# EAGLE schematic SUSTAINA-Control-Switches-Board (EAGLE 9.6.2)
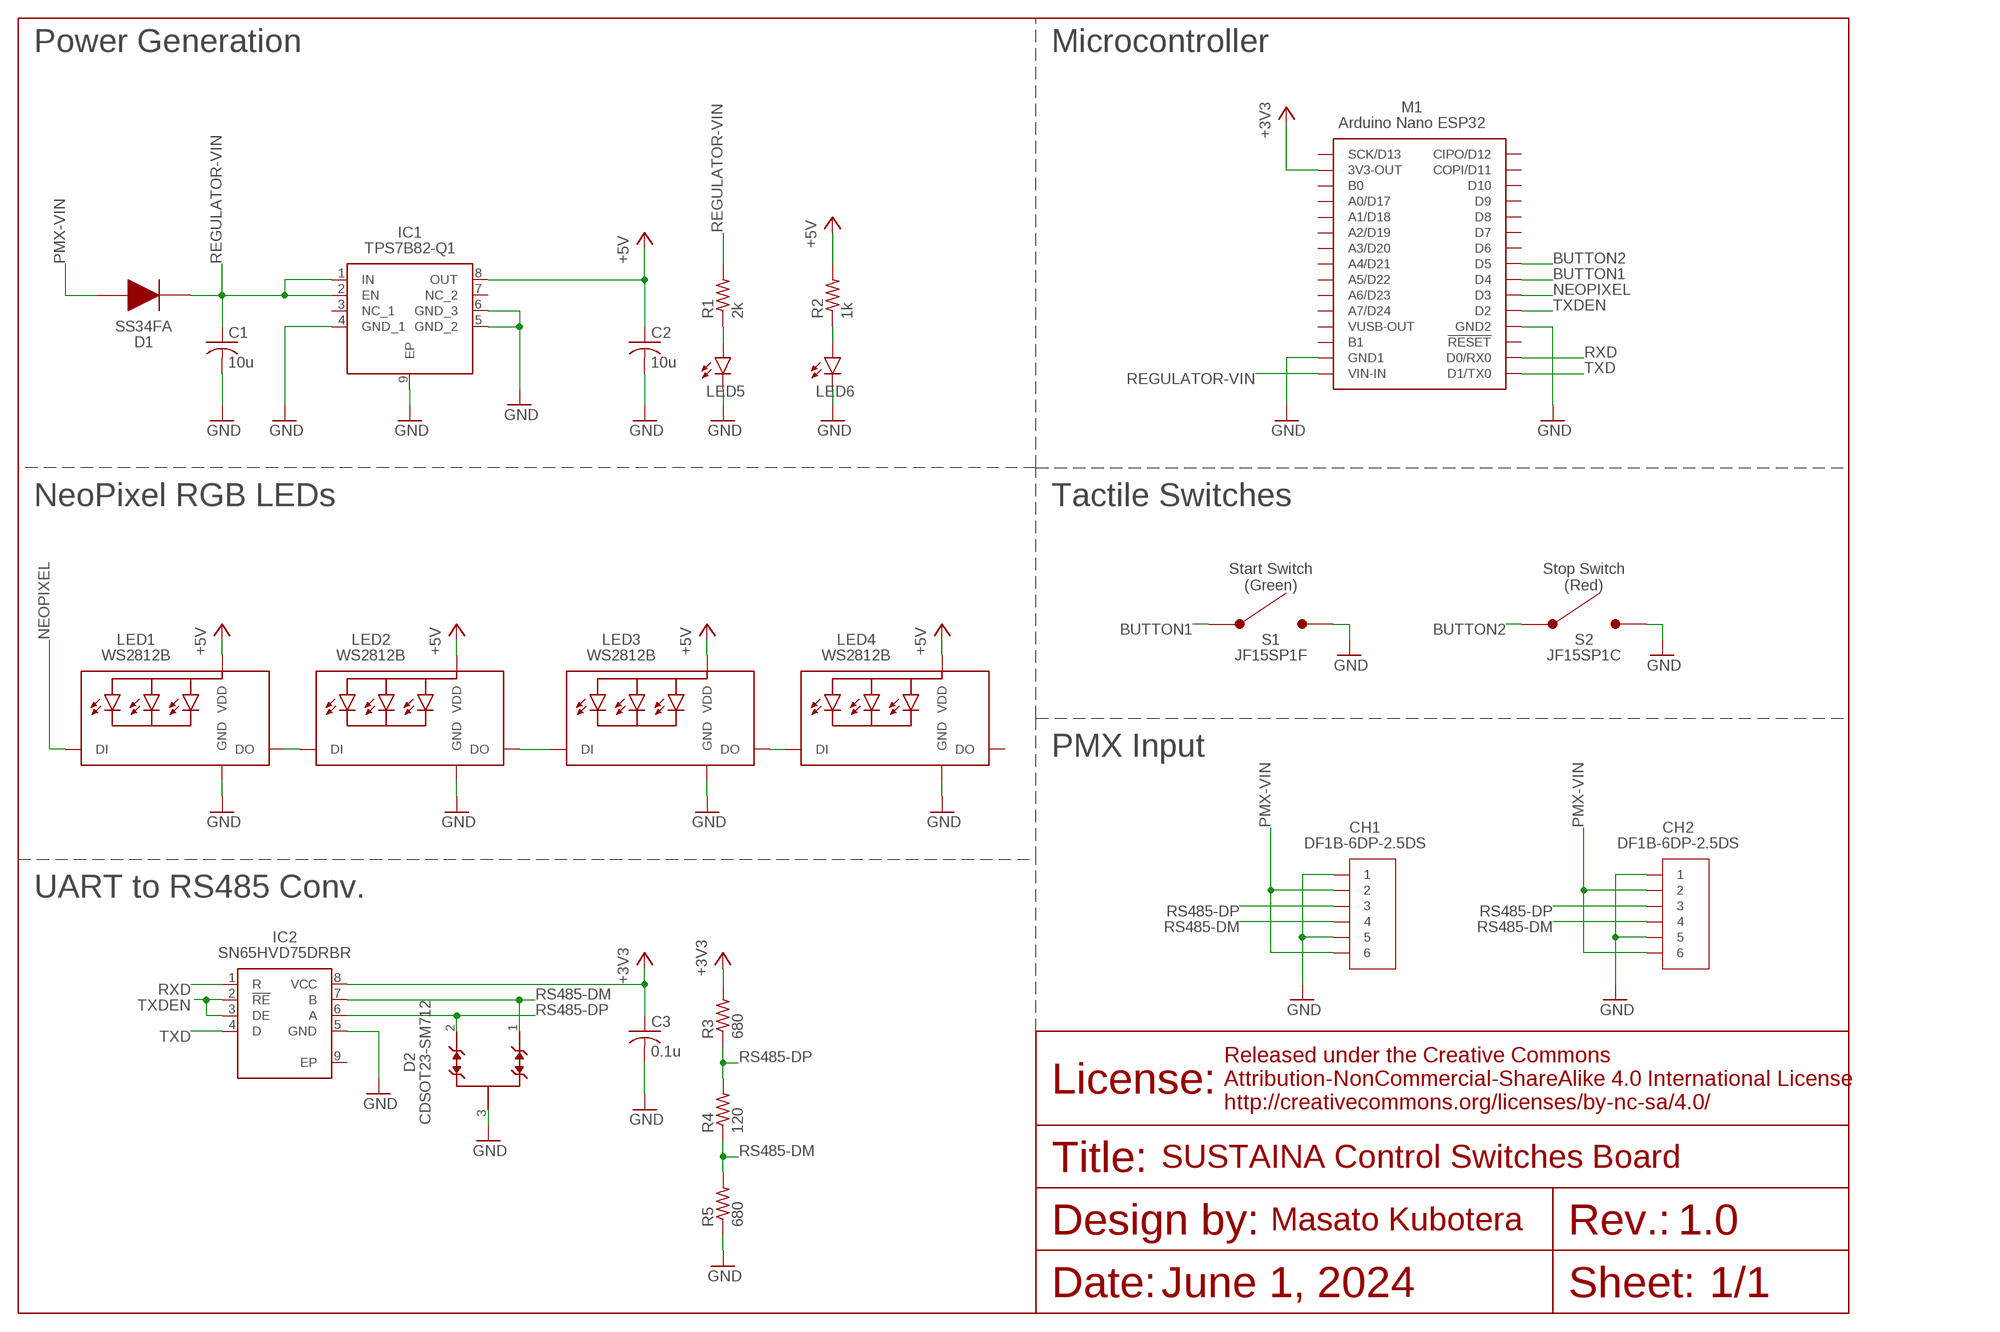
[diagram p0: schematic, sheet 1]

## Parts
C1  10u  C-USC0603  [C0603]
C2  10u  C-USC0603  [C0603]
C3  0.1u  C-USC0603  [C0603]
CH1  DF1B-6DP-2.5DS  [DF1B-6DP-2.5DS]
CH2  DF1B-6DP-2.5DS  [DF1B-6DP-2.5DS]
D1  SS34FA  [SS34FA]
D2  CDSOT23-SM712  [SOT-23-3]
IC1  TPS7B82-Q1  [SOP65P490X110-9N]
IC2  SN65HVD75DRBR  [SON65P300X300X100-9N]
LED1  WS2812B  [WS2812B]
LED2  WS2812B  [WS2812B]
LED3  WS2812B  [WS2812B]
LED4  WS2812B  [WS2812B]
LED5  LEDSML0603  [SML0603]
LED6  LEDSML0603  [SML0603]
M1  NANO-ESP32  [NANO-ESP32]
R1  2k  R-US_R0603  [R0603]
R2  1k  R-US_R0603  [R0603]
R3  680  R-US_R0603  [R0603]
R4  120  R-US_R0603  [R0603]
R5  680  R-US_R0603  [R0603]
S1  JF15SP1F  [JF15SP1]
S2  JF15SP1C  [JF15SP1]

## Nets
+3V3 [power]: C3.1 IC2.8(VCC) M1.3V3-OUT R3.2
+5V [high-power]: C2.1 IC1.8(OUT) LED1.1-VDD(VDD) LED2.1-VDD(VDD) LED3.1-VDD(VDD) LED4.1-VDD(VDD) R2.2
BUTTON1 [signal]: M1.D4 S1.1 S1.2
BUTTON2 [signal]: M1.D5 S2.1 S2.2
DO-DI-1 [signal]: LED1.2-DOUT(DO) LED2.4-DIN(DI)
DO-DI-2 [signal]: LED2.2-DOUT(DO) LED3.4-DIN(DI)
DO-DI-3 [signal]: LED3.2-DOUT(DO) LED4.4-DIN(DI)
GND [power]: C1.2 C2.2 C3.2 CH1.1 CH1.5 CH2.1 CH2.5 D2.3 IC1.4(GND_1) IC1.5(GND_2) IC1.6(GND_3) IC1.9(EP) IC2.5(GND) LED1.3-GND(GND) LED2.3-GND(GND) LED3.3-GND(GND) LED4.3-GND(GND) LED5.C LED6.C M1.GND1 M1.GND2 R5.1 S1.3 S1.4 S2.3 S2.4
LED-D-RX [low-power]: LED6.A R2.1
LED-D-TX [low-power]: LED5.A R1.1
NEOPIXEL [signal]: LED1.4-DIN(DI) M1.D3
PMX-VIN [high-power]: CH1.2 CH1.6 CH2.2 CH2.6 D1.2
REGULATOR-VIN [high-power]: C1.1 D1.1 IC1.1(IN) IC1.2(EN) M1.VIN-IN R1.2
RS485-DM [signal]: CH1.4 CH2.4 D2.1 IC2.7(B) R4.1 R5.2
RS485-DP [signal]: CH1.3 CH2.3 D2.2 IC2.6(A) R3.1 R4.2
RXD [signal]: IC2.1(R) M1.D0/RX0
TXD [signal]: IC2.4(D) M1.D1/TX0
TXDEN [signal]: IC2.2(!RE) IC2.3(DE) M1.D2
Unconnected: IC1.3(NC_1) IC1.7(NC_2) IC2.9(EP) LED4.2-DOUT(DO) M1.!RESET M1.A0/D17 M1.A1/D18 M1.A2/D19 M1.A3/D20 M1.A4/D21 M1.A5/D22 M1.A6/D23 M1.A7/D24 M1.B0 M1.B1 M1.CIPO/D12 M1.COPI/D11 M1.D6 M1.D7 M1.D8 M1.D9 M1.D10 M1.SCK/D13 M1.VUSB-OUT

## Notes on the sheet
- Power Generation | Microcontroller
- NeoPixel RGB LEDs | Tactile Switches
- Start Switch
  (Green)
- Stop Switch
  (Red)
- PMX Input
- UART to RS485 Conv.
- SUSTAINA Control Switches Board
- 1.0
- June 1, 2024 | 1/1

## Library data of the parts
C1-C3 = rcl:C-US: CAPACITOR, American symbol; SPICEPREFIX: C
CH1 CH2 = DF1B-6DP-2.5DS:DF1B-6DP-2.5DS
D1 = SS34FA:SS34FA
D2 = CDSOT23-SM712:CDSOT23-SM712
IC1 = TPS7B82-Q1:TPS7B82-Q1
IC2 = SN65HVD75DRBR:SN65HVD75DRBR
LED1-LED4 = WS2812B:WS2812B
LED5 LED6 = led:LED: LED OSRAM: - CHIPLED LG R971, LG N971, LY N971, LG Q971, LY Q971, LO R971, LY R971 LH N974, LH R974 LS Q976, LO Q976, LY Q976 LO Q996 - Hyper CHIPLED LW Q18S LB Q993, LB Q99A, LB R99A - SideLED LS A670, LO A670, LY A670, LG A670, LP A670 LB A673, LV A673, LT A673, LW A673 LH A674 LY A675 LS A676, LA A676, LO A676, LY A676, LW A676 LS A679, LY A679, LG A679 - Hyper Micro SIDELED® LS Y876, LA Y876, LO Y876, LY Y876 LT Y87S - SmartLED LW L88C, LW L88S LB L89C, LB L89S, LG L890 LS L89K, LO L89K, LY L89K LS L896, LA L896, LO L896, LY L896 - TOPLED LS T670, LO T670, LY T670, LG T670, LP T670 LSG T670, LSP T670, LSY T670, LOP T670, LYG T670 LG T671, LOG T671, LSG T671 LB T673, LV T673, LT T673, LW T673 LH T674 LS T676, LA T676, LO T676, LY T676, LB T676, LH T676, LSB T676, LW T676 LB T67C, LV T67C, LT T67C, LS T67K, LO T67K, LY T67K, LW E67C LS E67B, LA E67B, LO E67B, LY E67B, LB E67C, LV E67C, LT E67C LW T67C LS T679, LY T679, LG T679 LS T770, LO T770, LY T770, LG T770, LP T770 LB T773, LV T773, LT T773, LW T773 LH T774 LS E675, LA E675, LY E675, LS T675 LS T776, LA T776, LO T776, LY T776, LB T776 LHGB T686 LT T68C, LB T68C - Hyper Mini TOPLED® LB M676 - Mini TOPLED Santana® LG M470 LS M47K, LO M47K, LY M47K Source: http://www.osram.convergy.de LUXEON: - LUMILED® LXK2-PW12-R00, LXK2-PW12-S00, LXK2-PW14-U00, LXK2-PW14-V00 LXK2-PM12-R00, LXK2-PM12-S00, LXK2-PM14-U00 LXK2-PE12-Q00, LXK2-PE12-R00, LXK2-PE12-S00, LXK2-PE14-T00, LXK2-PE14-U00 LXK2-PB12-K00, LXK2-PB12-L00, LXK2-PB12-M00, LXK2-PB14-N00, LXK2-PB14-P00, LXK2-PB14-Q00 LXK2-PR12-L00, LXK2-PR12-M00, LXK2-PR14-Q00, LXK2-PR14-R00 LXK2-PD12-Q00, LXK2-PD12-R00, LXK2-PD12-S00 LXK2-PH12-R00, LXK2-PH12-S00 LXK2-PL12-P00, LXK2-PL12-Q00, LXK2-PL12-R00 Source: www.luxeon.com KINGBRIGHT: KA-3528ASYC Source: www.kingbright.com
M1 = Arduino:NANO-ESP32
R1-R5 = rcl:R-US_: RESISTOR, American symbol; SPICEPREFIX: R
S1 = NKK_Switches:JF15SP1F
S2 = NKK_Switches:JF15SP1C

## Net classes
0 default: width 0.203 mm
1 signal: width 0.203 mm, clearance 0.127 mm
2 power: width 0.381 mm
3 low-power: width 0.254 mm
4 high-power: width 0.508 mm